# Altium schematic sheet BUTTON_LED.SchDoc
size 420 x 297 mm; SheetNumber: 26; SheetTotal: 32
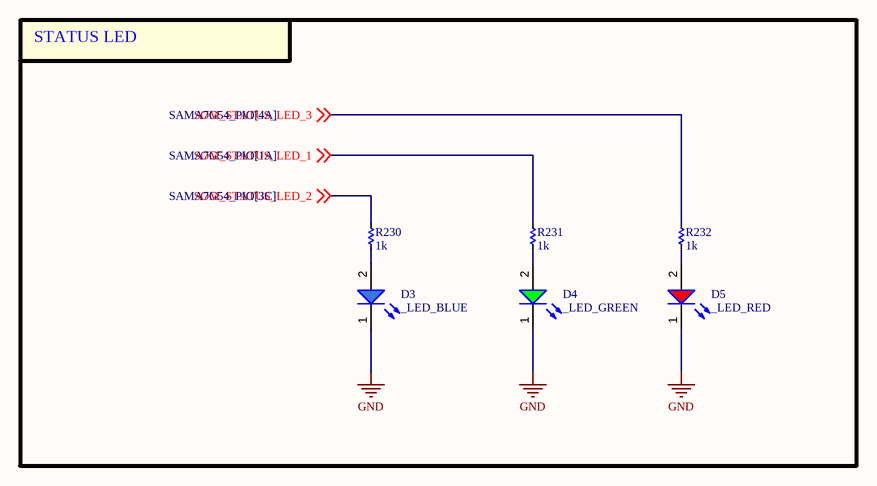
[diagram p0: BUTTON_LED.SchDoc]

## Parts
D3  _LED_BLUE  [LED_0603]
D4  _LED_GREEN  [LED_0603]
D5  _LED_RED  [LED_0603]
R230  1k  [RES_C_1005x30_L]
R231  1k  [RES_C_1005x30_L]
R232  1k  [RES_C_1005x30_L]

## Blocks framed on the sheet
STATUS LED: D3-D5 R230-R232

## Nets
GND: D3.1(K) D4.1(K) D5.1(K)
SOM_STATUS_LED_1: R231.2 ; off-sheet SOM_STATUS_LED_1
SOM_STATUS_LED_2: R230.2 ; off-sheet SOM_STATUS_LED_2
SOM_STATUS_LED_3: R232.2 ; off-sheet SOM_STATUS_LED_3
NetD3_2: D3.2(A) R230.1
NetD4_2: D4.2(A) R231.1
NetD5_2: D5.2(A) R232.1

## Notes on the sheet
- Project:
- Sub-system:
- Design by:
- Sheet title:
- Sheet
- A3
- of
- Checked by:
- Approved by:
- Revision:
- Document No:
- Size:
- Date:

## Library data of the parts
D3 = LED_BLUE: LED BLUE CLEAR 0603 SMD
D4 = LED_GREEN: LED GREEN CLEAR 0603 SMD
D5 = LED_RED: LED RED CLEAR 0603 SMD
R230-R232 = _RES_B_2: RES